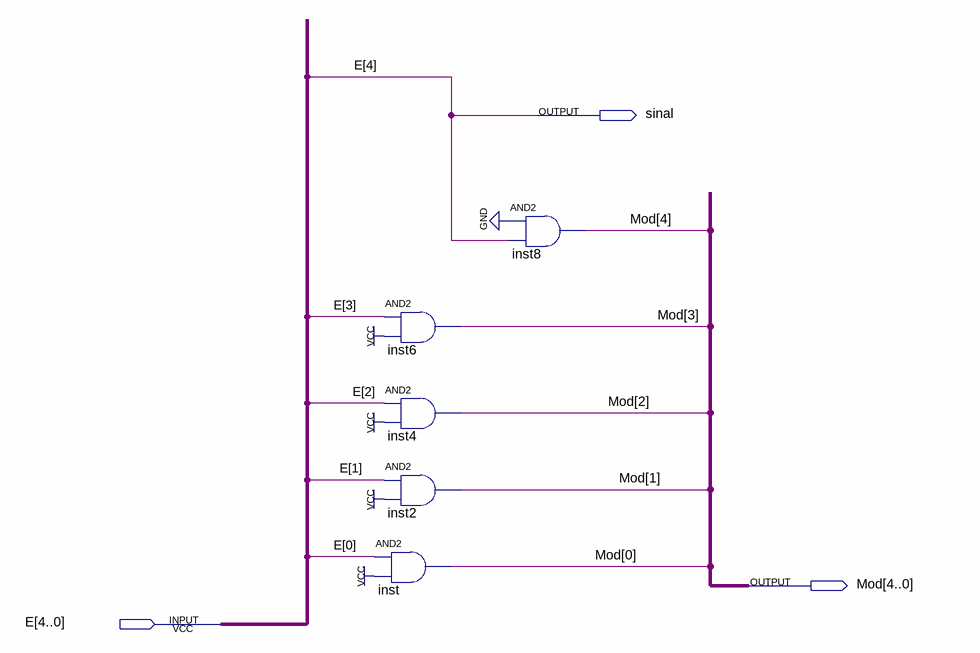
[diagram p0: schematic sheet]
// Quartus schematic separa_sinal.bdf as structural Verilog: 5 symbols, 3 pins
module separa_sinal (
  input  [4:0] E,
  output sinal,
  output [4:0] Mod
);

  and inst6 (Mod[3], E[3], 1'b1);
  and inst4 (Mod[2], E[2], 1'b1);
  and inst2 (Mod[1], E[1], 1'b1);
  and inst (Mod[0], E[0], 1'b1);
  and inst8 (Mod[4], 1'b0, E[4]);

  assign sinal = E[4];
endmodule
